# Altium schematic sheet RcTransmitterPower.SchDoc
size A4; SheetNumber: 1; SheetTotal: 3
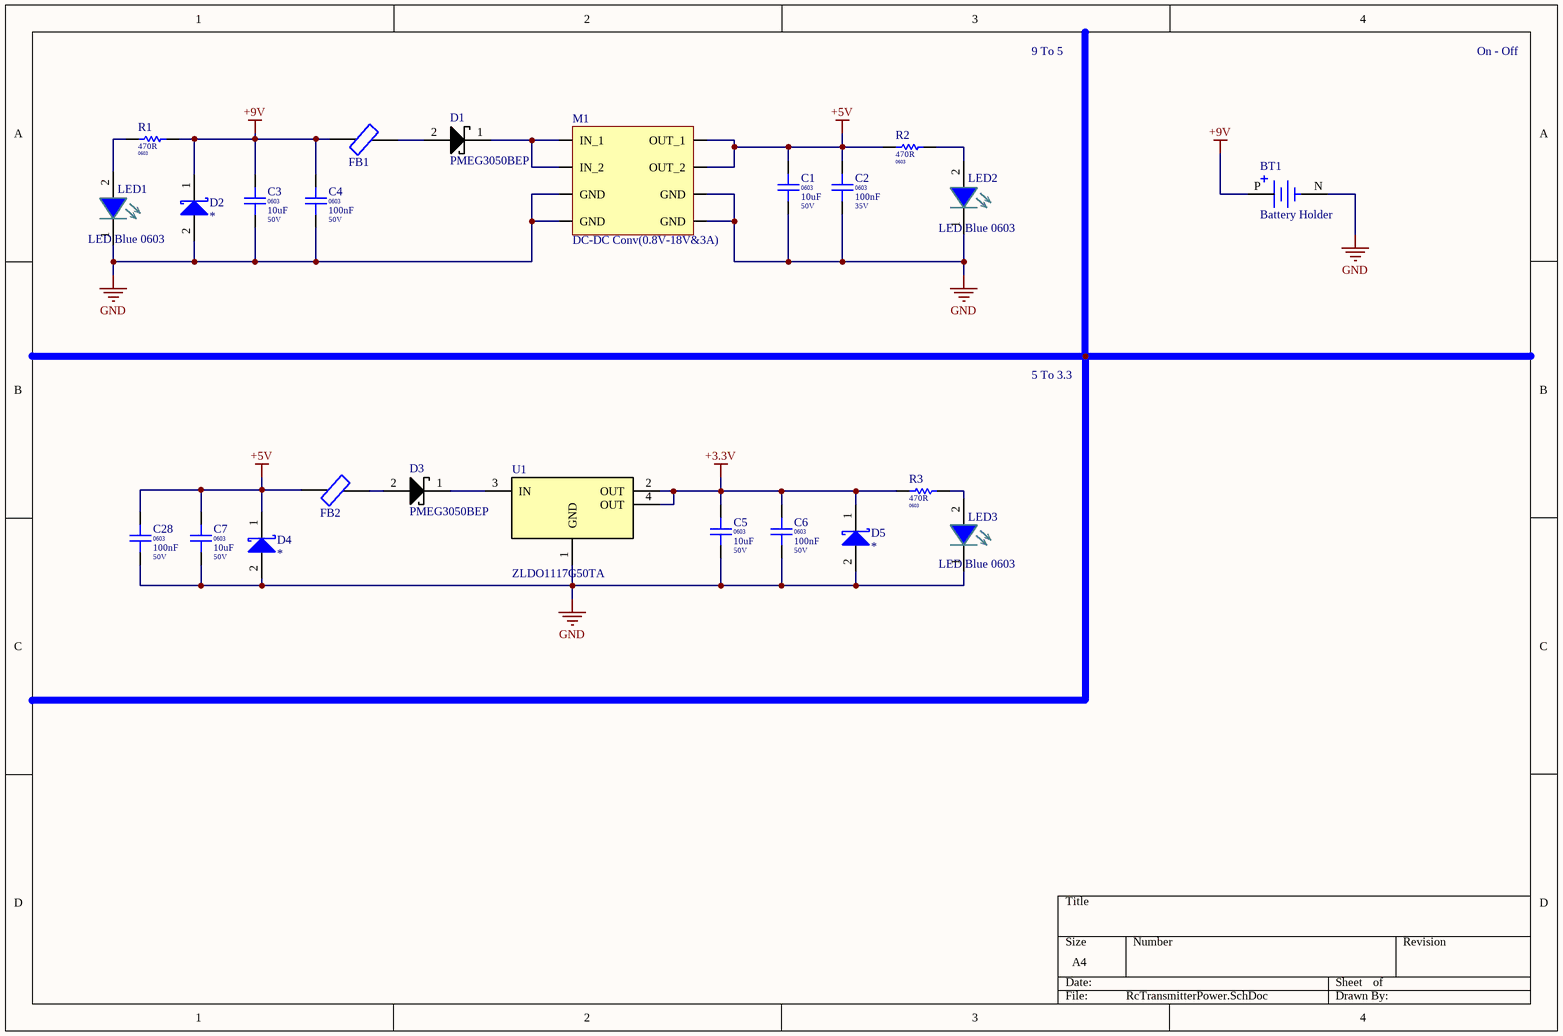
[diagram p0: RcTransmitterPower.SchDoc]

## Parts
BT1  Battery Holder  [BAT_BC9VPC]
C1  Package / Case: 0603  Voltage: 50V  [CAPC 0603]  (hidden comment: 10uF)
C2  Package / Case: 0603  Voltage: 35V  [CAPC 0603]  (hidden comment: 100nF)
C3  Package / Case: 0603  Voltage: 50V  [CAPC 0603]  (hidden comment: 10uF)
C4  Package / Case: 0603  Voltage: 50V  [CAPC 0603]  (hidden comment: 100nF)
C5  Package / Case: 0603  Voltage: 50V  [CAPC 0603]  (hidden comment: 10uF)
C6  Package / Case: 0603  Voltage: 50V  [CAPC 0603]  (hidden comment: 100nF)
C7  Package / Case: 0603  Voltage: 50V  [CAPC 0603]  (hidden comment: 10uF)
C28  Package / Case: 0603  Voltage: 50V  [CAPC 0603]  (hidden comment: 100nF)
D1  PMEG3050BEP  [SOD470X100-2N]
D2  *  [DO-214AC, SMA]
D3  PMEG3050BEP  [SOD470X100-2N]
D4  *  [DO-214AC, SMA]
D5  *  [DO-214AC, SMA]
FB1  Ferrite Bead  [FCM1608KF-601T03]  (value not drawn)
FB2  Ferrite Bead  [FCM1608KF-601T03]  (value not drawn)
LED1  LED Blue 0603  [LED BLUE 0603]
LED2  LED Blue 0603  [LED BLUE 0603]
LED3  LED Blue 0603  [LED BLUE 0603]
M1  DC-DC Conv(0.8V-18V&3A)  [mp]
R1  Package / Case: 0603  [RESC 0603]  (hidden comment: 470R)
R2  Package / Case: 0603  [RESC 0603]  (hidden comment: 470R)
R3  Package / Case: 0603  [RESC 0603]  (hidden comment: 470R)
U1  ZLDO1117G50TA  [1117]

## Nets
+3.3V: C5.2 C6.2 D5.1(K) R3.2 U1.2(OUT) U1.4(OUT)
+5V: C1.2 C2.2 C7.2 C28.2 D4.1(K) FB2.1 M1.3(OUT_1) M1.4(OUT_2) R2.2
+9V: BT1.P(POS) C3.2 C4.2 D2.1(K) FB1.1 R1.1
GND: BT1.N(NEG) C1.1 C2.1 C3.1 C4.1 C5.1 C6.1 C7.1 C28.1 D2.2(A) D4.2(A) D5.2(A) LED1.1 LED2.1 LED3.1 M1.5(GND) M1.6(GND) M1.7(GND) M1.8(GND) U1.1(GND)
NetD1_1: D1.1(K) M1.1(IN_1) M1.2(IN_2)
NetD1_2: D1.2(A) FB1.2
NetD3_1: D3.1(K) U1.3(IN)
NetD3_2: D3.2(A) FB2.2
NetLED1_2: LED1.2 R1.2
NetLED2_2: LED2.2 R2.1
NetLED3_2: LED3.2 R3.1

## Notes on the sheet
- 9 To 5
- On - Off
- 5 To 3.3

## Library data of the parts
BT1 = Battery Holder: BATTERY HOLDER 9V PC PIN; MF: MPD; MP: BC9VPC; Check_prices: https://www.snapeda.com/parts/BC9VPC/MPD/view-part/4389071/?ref=eda; Package: None; Value: *; Price: None; Availability: Warning; SnapEDA_Link: https://www.snapeda.com/parts/BC9VPC/MPD/view-part/4389071/?ref=snap; Purchase-URL: https://pricing.snapeda.com/search/part/BC9VPC/?ref=eda
C1 C3 C5 C7 = CAPC0301: Capacitor Ceramic 10uF 50V 0603; Tolerance: %10; Value Rating: uF; Value: 10uF; Part Number: CAPC0301; Category: Capacitor Ceramic; Values: 10uF 50V
C2 = CAPC0328: Capacitor Ceramic 100nF 35V 0603; Tolerance: %10; Value Rating: nF; Value: 100nF; Part Number: CAPC0328; Category: Capacitor Ceramic; Values: 100nF 35V
C4 C6 C28 = CAPC0285: Capacitor Ceramic 100nF 50V 0603; Tolerance: %10; Value Rating: nF; Favorites: Favorite; Value: 100nF; Part Number: CAPC0285; Category: Capacitor Ceramic; Values: 100nF 50V
D1 D3 = Schotky Diode: Manufacturer: Nexperia USA; Manufacturer Part Number: PMEG3050BEP,115; Supplier 1: Digi-Key; Supplier Part Number 1: 1727-5207-1-ND; Stock 1: 62590; Pricing 1: 1=0.44, 10=0.373, 100=0.2786, 500=0.2189, 1000=0.1692 (USD)
D2 D4 D5 = Diode0012: Values: FILL!!!; Diode Type: Schottky; Manufacturer Part Number: *; Part Number: Diode0012; Category: Diode Schottky; Package / Case: DO-214AC, SMA; Voltage - DC Reverse (Vr): FILL!!!; Voltage - Forward (Vf): FILL!!!; Current: FILL!!!; Speed: FILL!!!
FB1 FB2 = FCM1608KF-601T03
M1 = MP1584EN
R1-R3 = R0188: 470R 0603; Part Number: R0188; Tolerance: %5; Power: 1/10W; Value: 470R; Category: Resistor; Values: 470R
U1 = ZLDO1117G50TA: IC REG LDO 5V 1A SOT223